# Altium project Step Moter Control.PrjPCB
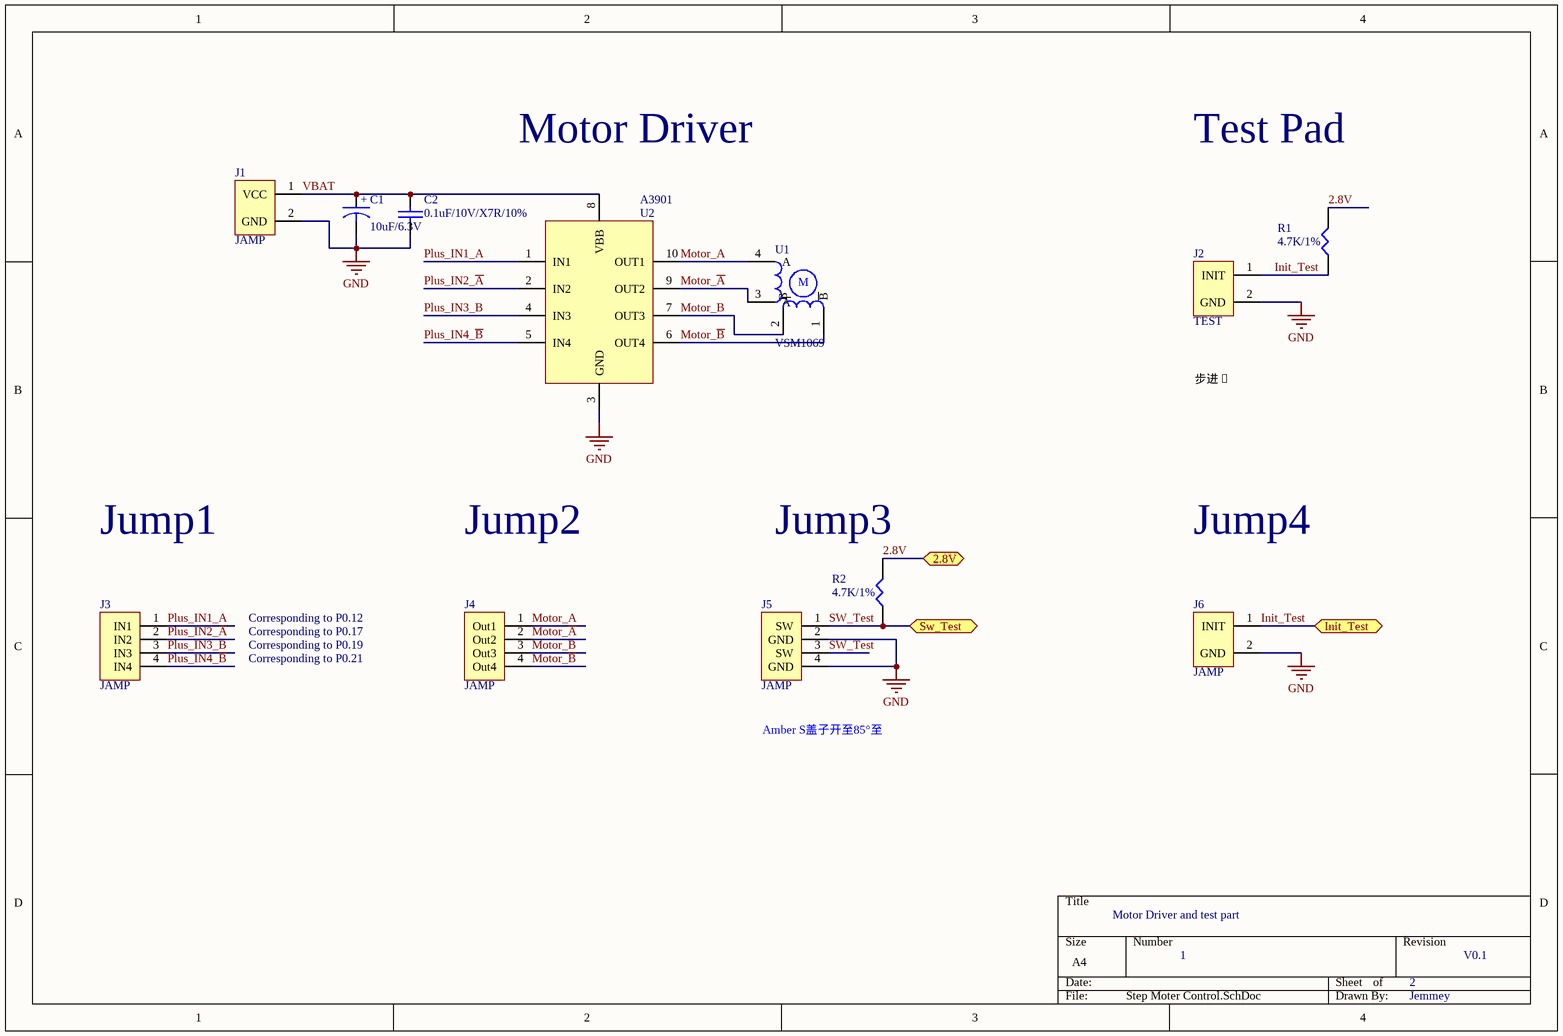
[diagram p0: Step Moter Control.SchDoc]
2 sheets, 20 parts. Net scope: flat (ports and power ports of the same name join across sheets).
Board file: Step Moter Control.PcbDoc
Sheets:
  Step Moter Control.SchDoc
  Remote 8-bit I2C .SchDoc

## Sheet Step Moter Control.SchDoc
size A4

### Parts
C1  10uF/6.3V  [3216]
C2  0.1uF/10V/X7R/10%  [0402C]
J1  JAMP  [Debug- 1.27*2]
J2  TEST  [Debug- 1.27*2]
J3  JAMP  [Debug- 1.27*4]
J4  JAMP  [Debug- 1.27*4]
J5  JAMP  [Debug- 1.27*4]
J6  JAMP  [Debug- 1.27*2]
R1  4.7K/1%  [0402R]
R2  4.7K/1%  [0402R]
U1  VSM1069  [FPC_CON5-6200]
U2  A3901  [DFN10]

### Ports
2.8V, Init_Test, Sw_Test

### Nets
2.8V: R1.2 R2.2 ; port 2.8V
GND: C1.2 C2.2 J1.2(GND) J2.2(GND) J5.2(GND) J5.4(GND) J6.2(GND) U2.3(GND)
Init_Test: J2.1(INIT) J6.1(INIT) R1.1 ; port Init_Test
Motor_A: J4.1(Out1) U1.4(A) U2.10(OUT1)
Motor_~{A}: J4.2(Out2) U1.3(~{A}) U2.9(OUT2)
Motor_B: J4.3(Out3) U1.2(B) U2.7(OUT3)
Motor_~{B}: J4.4(Out4) U1.1(~{B}) U2.6(OUT4)
Plus_IN1_A: J3.1(IN1) U2.1(IN1)
Plus_IN2_~{A}: J3.2(IN2) U2.2(IN2)
Plus_IN3_B: J3.3(IN3) U2.4(IN3)
Plus_IN4_~{B}: J3.4(IN4) U2.5(IN4)
SW_Test: J5.1(SW) J5.3(SW) R2.1 ; port Sw_Test
VBAT: C1.1 C2.1 J1.1(VCC) U2.8(VBB)

### Notes on the sheet
- Motor Driver
- Test Pad
- 步进�
- Jump1
- Jump2
- (near R2) Jump3
- Jump4
- Corresponding to P0.19
- Corresponding to P0.17
- Corresponding to P0.12
- Corresponding to P0.21
- Amber S盖子开至85°至
- Motor Driver and test part
- 1
- 2
- V0.1
- Jemmey
- (in symbol Cap) +
- (in symbol VSM1069) M

### Library data of the parts
C1 = Cap: 厂家：ROHM，型号：
C2 = CAP: 厂家：Murata，型号：GRM155R71A104KA01D
J1 J3-J6 = JAMP: 厂家：暂定，型号：暂定
J2 = TEST: 厂家：暂定，型号：暂定
R1 R2 = RES1: 厂家：Yageo，型号：RC0402FR-074K7L
U1 = VSM1069: 厂家：常州唯可泰，型号：VSM1069；二相步进电机
U2 = A3901: 厂家：Allegro ，型号：A3901 Two phase stepper motor drives

## Sheet Remote 8-bit I2C .SchDoc
size A4
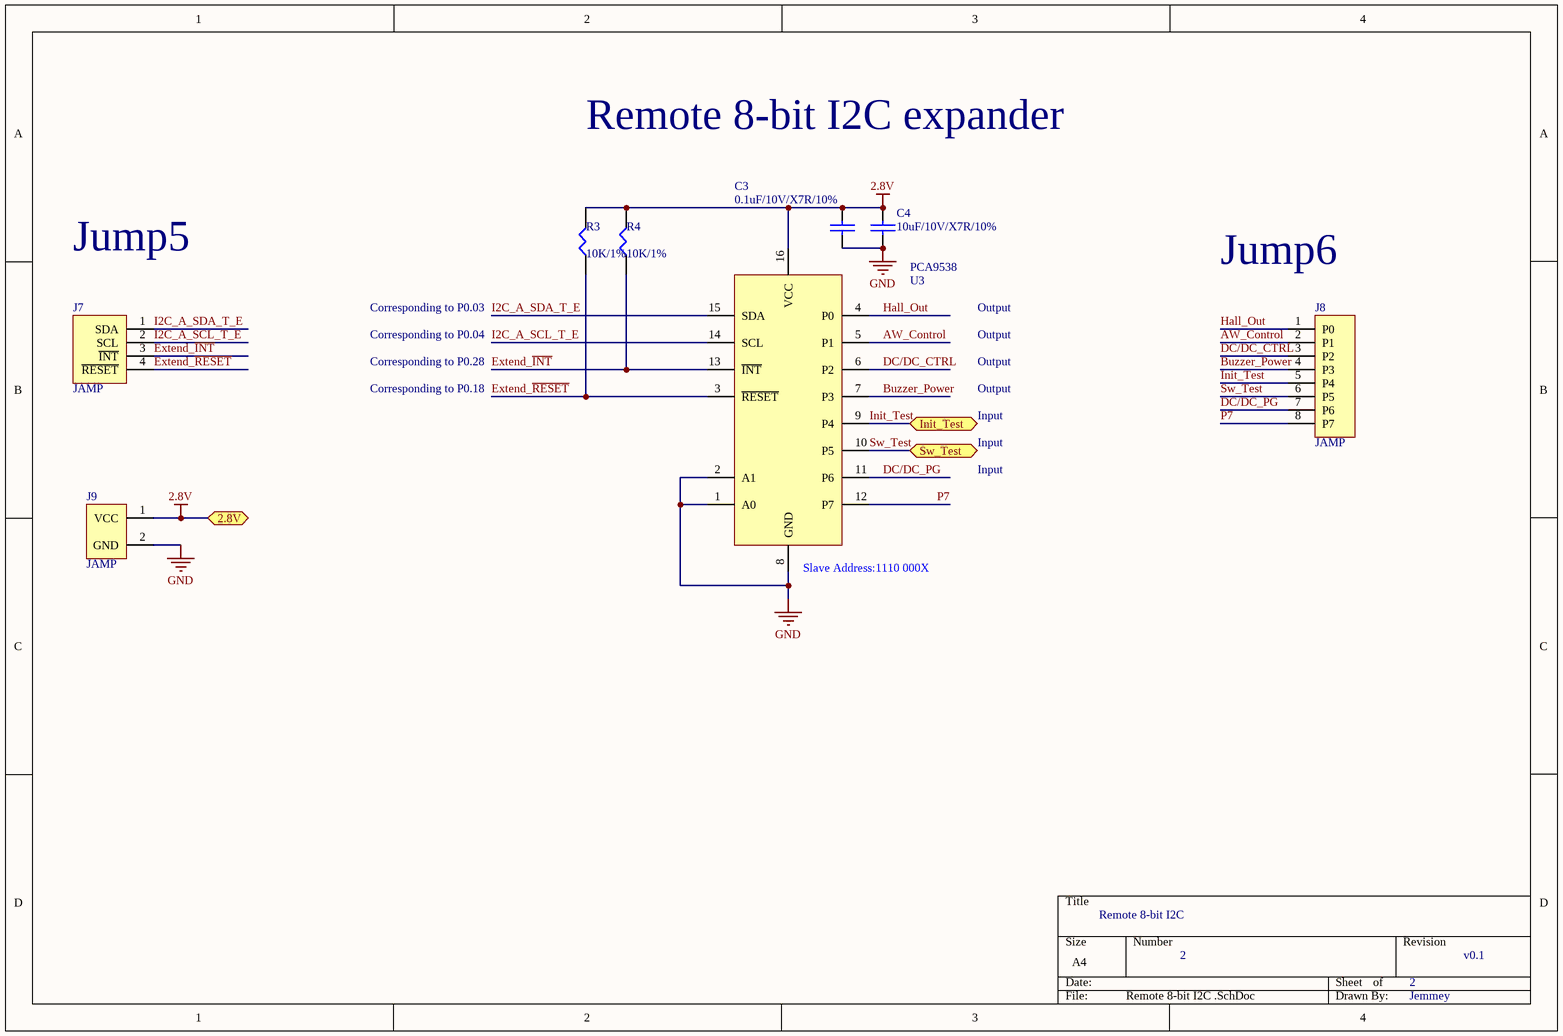
[diagram p1: Remote 8-bit I2C .SchDoc]

### Parts
C3  0.1uF/10V/X7R/10%  [0402C]
C4  10uF/10V/X7R/10%  [0603C]
J7  JAMP  [Debug- 1.27*4]
J8  JAMP  [Debug- 1.27*8]
J9  JAMP  [Debug- 1.27*2]
R3  10K/1%  [0402R]
R4  10K/1%  [0402R]
U3  PCA9538  [TSSOP-16]

### Ports
2.8V, Init_Test, Sw_Test

### Nets
2.8V: C3.1 C4.1 J9.1(VCC) R3.2 R4.2 U3.16(VCC) ; port 2.8V
GND: C3.2 C4.2 J9.2(GND) U3.1(A0) U3.2(A1) U3.8(GND)
AW_Control: J8.2(P1) U3.5(P1)
Buzzer_Power: J8.4(P3) U3.7(P3)
DC/DC_CTRL: J8.3(P2) U3.6(P2)
DC/DC_PG: J8.7(P6) U3.11(P6)
Extend_~{INT}: J7.3(~{INT}) R4.1 U3.13(~{INT})
Extend_~{RESET}: J7.4(~{RESET}) R3.1 U3.3(~{RESET})
Hall_Out: J8.1(P0) U3.4(P0)
I2C_A_SCL_T_E: J7.2(SCL) U3.14(SCL)
I2C_A_SDA_T_E: J7.1(SDA) U3.15(SDA)
Init_Test: J8.5(P4) U3.9(P4) ; port Init_Test
P7: J8.8(P7) U3.12(P7)
SW_Test: J8.6(P5) U3.10(P5) ; port Sw_Test

### Notes on the sheet
- Remote 8-bit I2C expander
- Jump5
- Corresponding to P0.03
- Output
- Jump6
- Corresponding to P0.28
- Corresponding to P0.04
- Corresponding to P0.18
- Input
- (near U3) Slave Address:1110 000X
- Remote 8-bit I2C
- 2
- v0.1
- Jemmey

### Library data of the parts
C3 = CAP: 厂家：Murata，型号：GRM155R71A104KA01D
C4 = CAP: 厂家：Murata，型号：GRM188R61A106KE69D
J7-J9 = JAMP: 厂家：暂定，型号：暂定
R3 R4 = RES1: 厂家：Yageo，型号：RC0402FR-0710KL
U3 = PCA9538: 厂家：TI，型号：PCA9538 Remote 8-bit I2C with interrupt output

## Nets that join several sheets
2.8V: Step Moter Control (R1.2 R2.2), Remote 8-bit I2C  (6 pins)
GND: Step Moter Control (8 pins), Remote 8-bit I2C  (6 pins)
Init_Test: Step Moter Control (J2.1 J6.1 R1.1), Remote 8-bit I2C  (J8.5 U3.9)
SW_Test: Step Moter Control (J5.1 J5.3 R2.1), Remote 8-bit I2C  (J8.6 U3.10)